# Altium project PirSensor.PrjPcb
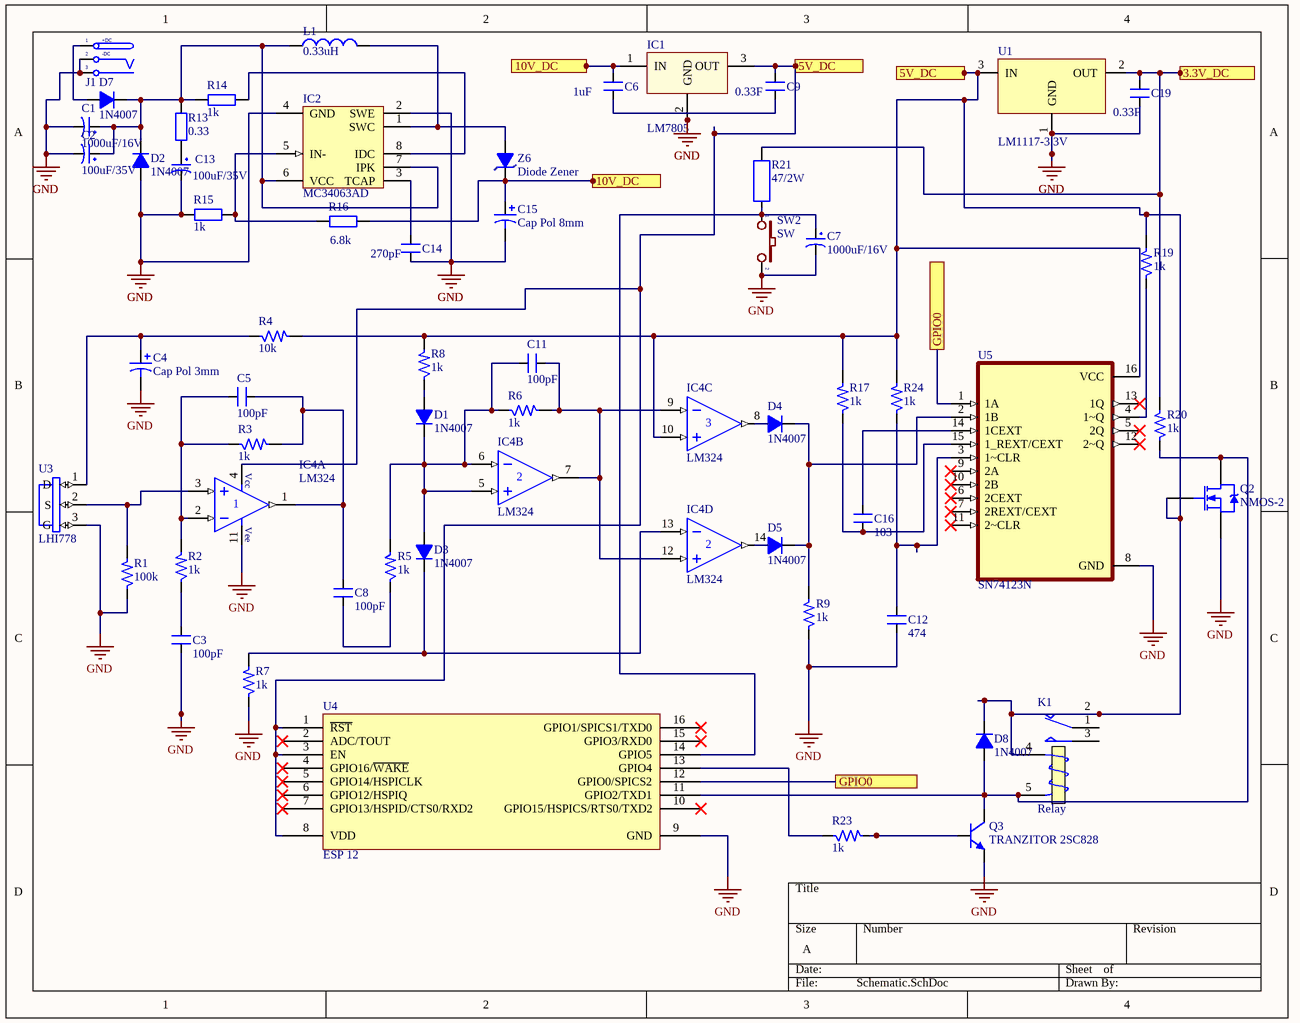
[diagram p0: Schematic.SchDoc]
1 sheet, 56 parts. Net scope: flat (ports and power ports of the same name join across sheets).
Board file: PCB.PcbDoc

## Sheet Schematic.SchDoc
size A; SheetNumber: 1; SheetTotal: 1

### Parts
C1  1000uF/16V  [CP1.5/3.4]
C2  100uF/35V  [CP1.5/3.4]
C3  100pF  [CN1]
C4  Cap Pol 3mm  [C3MM]
C5  100pF  [CN1]
C6  1uF  [CN1]
C7  1000uF/16V  [CP1.5/3.4]
C8  100pF  [CN1]
C9  0.33F  [CN1]
C11  100pF  [CN1]
C12  474  [CN4]
C13  100uF/35V  [CP1.5/3.4]
C14  270pF  [CN1]
C15  Cap Pol 8mm  [C10mm]
C16  103  [CN1.5]
C19  0.33F  [CN1]
D1  1N4007  [D2A]
D2  1N4007  [D1A]
D3  1N4007  [D2A]
D4  1N4007  [D2A]
D5  1N4007  [D2A]
D7  1N4007  [D1A]
D8  1N4007  [D1A]
IC1  LM7805  [QTO-220NH]
IC2  MC34063AD  [DIP8]
IC4  LM324  [DIP14]  (parts A,B,C,D of 4)
J1  JACK DC 5MM  [JACK DC 5MM]  (value not drawn)
K1  Relay  [MODULE5B]
L1  value 0.33uH  [PCMC063T]
Q2  NMOS-2  [TO-220AB]
Q3  TRANZITOR 2SC828  [TO126]
R1  100k  [R1/8W]
R2  1k  [R1/8W]
R3  1k  [R1/8W]
R4  10k  [R1/8W]
R5  1k  [R1/8W]
R6  1k  [R1/8W]
R7  1k  [R1/8W]
R8  1k  [R1/8W]
R9  1k  [R1/8W]
R13  0.33  [RES-1/4W]
R14  1k  [R1/8W]
R15  1k  [R1/8W]
R16  6.8k  [R1/8W]
R17  1k  [R1/8W]
R19  1k  [R1/8W]
R20  1k  [R1/4W]
R21  47/2W  [R2W]
R23  1k  [R1/4W]
R24  1k  [R1/8W]
SW2  SW  [SW2]
U1  LM1117-3.3V  [LM1117-SOP]
U3  LHI778  [SNR3-D8.1XH4.2MM]
U4  ESP 12  [ESP12]
U5  SN74123N  [DIP794W45P254L1969H508Q16]
Z6  Diode Zener  [D1A]

### Ports
3.3V_DC, 5V_DC, 10V_DC, GPIO0

### Nets
GND: C1.2 C2.2 C3.1 C4.2 C7.2 C12.1 C13.2 C14.1 C15.2 C19.1 D2.1(A) IC1.2(GND) IC2.2(SWE) IC2.4(GND) IC4.11(V-) J1.2(TN) J1.3(S) Q2.3(S) Q3.1(E) R1.1 R7.1 R9.1 R15.1 SW2.2 U1.1(GND) U3.3(G) U4.9(GND) U5.8(GND)
NetC1_1: C1.1 C2.1 D2.2(K) D7.2(K) IC2.6(VCC) IC2.7(IPK) L1.1 R13.2 R14.1
NetC3_2: C3.2 R2.1
NetC4_1: C4.1 R4.1 U3.1(D)
NetC5_1: C5.1 IC4.2(IN-) R2.2 R3.1
NetC5_2: C5.2 C8.2 IC4.1(OUT) R3.2
NetC6_1: C6.1 C9.1
NetC6_2: C6.2 C15.1 IC1.1(IN) R16.2 Z6.2(K) ; port 10V_DC
NetC7_1: C7.1 R21.1 SW2.1 U4.14(GPIO5)
NetC8_1: C8.1 R5.1
NetC9_2: C9.2 D8.2(K) IC1.3(OUT) IC4.4(V+) IC4.10(IN+) K1.2(NC) K1.4(T1) Q2.1(G) R4.2 R8.2 R17.2 R19.2 R24.2 U1.3(IN) U4.1(~{RST}) U4.3(EN) U4.8(VDD) U5.16(VCC) ; port 5V_DC
NetC11_1: C11.1 D1.2(K) D3.1(A) IC4.5(IN+) IC4.6(IN-) R5.2 R6.1
NetC11_2: C11.2 IC4.7(OUT) IC4.9(IN-) IC4.12(IN+) R6.2
NetC12_2: C12.2 R24.1 U5.3(1~CLR)
NetC13_1: C13.1 R13.1
NetC14_2: C14.2 IC2.3(TCAP)
NetC16_1: C16.1 R17.1 U5.15(1_REXT/CEXT)
NetC16_2: C16.2 U5.14(1CEXT)
NetC19_2: C19.2 R20.2 R21.2 U1.2(OUT) ; port 3.3V_DC
NetD1_1: D1.1(A) R8.1
NetD3_2: D3.2(K) IC4.13(IN-) R7.2
NetD4_1: D4.1(A) IC4.8(OUT)
NetD4_2: D4.2(K) D5.2(K) R9.2 U5.2(1B)
NetD5_1: D5.1(A) IC4.14(OUT)
NetD7_1: D7.1(A) J1.1(T)
NetD8_1: D8.1(A) K1.5(T2) Q2.2(D) Q3.3(B) R20.1 U4.11(GPIO2/TXD1)
NetIC2_1: IC2.1(SWC) L1.2 Z6.1(A)
NetIC2_5: IC2.5(IN-) R15.2 R16.1
NetIC2_8: IC2.8(IDC) R14.2
NetIC4_3: IC4.3(IN+) R1.2 U3.2(S)
NetQ3_2: Q3.2(C) R23.2
NetR19_1: R19.1 U5.4(1~Q)
NetR23_1: R23.1 U4.13(GPIO4)
NetU4_12: U4.12(GPIO0/SPICS2) U5.1(1A) ; port GPIO0

Not connected (* = marked no-connect by the designer): K1 1(COM) 3(NO); U4 2(ADC/TOUT)* 4(GPIO16/~{WAKE})* 5(GPIO14/HSPICLK)* 6(GPIO12/HSPIQ)* 7(GPIO13/HSPID/CTS0/RXD2)* 10(GPIO15/HSPICS/RTS0/TXD2)* 15(GPIO3/RXD0)* 16(GPIO1/SPICS1/TXD0)*; U5 5(2Q)* 6(2CEXT)* 7(2REXT/CEXT)* 9(2A)* 10(2B)* 11(2~CLR)* 12(2~Q)* 13(1Q)*

### Notes on the sheet
- (in symbol JACK DC 5MM) +DC; -DC
- (in symbol LM324, part A) Vcc; Vee

### Library data of the parts
C1 C7 = CP4: Cap 1000uF/16V - 220uF/50V; Description 5: 4,7uF>10uF/250V_3,3uF>10uF/400V - 2,2uF>4,7uF/450V; Description 1: 2200uF-3300uF/6,3V - 1000uF-2200uF/10V; Description 2: 1000uF/16V - 470uF => 1000uF/25V - 100uF/100V; Description 3: 330uF>470uF/35V_220uF>470uF/50V_10uF>22uF/250V; Description 4: 220uF => 330uF/63V - 10uF =>33uF/160 - 200V; Value: 1000uF/16V
C2 C13 = CP3: Cap 100uF/35V - 470uF/16V; Value: 100uF/35V/50V; Description 1: 1000uF/6,3V - 470uF/16V - 330uF - 25V; Description 2: 220uF/35V - 100uF/50V - 63V - 4,7uF/200V; Description 3: 22uF => 33uF100V - 3,3uF => 4,7uF/250V; Description 4: 2,2uF =>3,3uF/350 - 2,2uF/400V - 1uF/450V
C3 C5 C8 C11 = CN1: Cap np  1pF - 472pF; Value: 100pF
C4 = Cap Pol 3mm: Polarized Capacitor (Axial); Published: 8-Jun-2000; LatestRevisionDate: 17-Jul-2002; LatestRevisionNote: Re-released for DXP Platform.; PackageReference: POLAR0.8; Publisher: Altium Limited
C6 C9 C14 C19 = CN1: Cap np  1pF - 472pF; Value: 100pF
C12 = CN4: Cap np W0.4; Value: 0.47uF
C15 = Cap Pol 8mm: Polarized Capacitor (Axial); Published: 8-Jun-2000; LatestRevisionDate: 17-Jul-2002; LatestRevisionNote: Re-released for DXP Platform.; PackageReference: POLAR0.8; Publisher: Altium Limited
C16 = CN1.5: Cap np 682pF => 104pF; Value: 0.01uF
D1-D5 D7 D8 = D1A: Diode 1A; Value: 1N4007
IC1 = LM78xx: On ap +, from + 5 to + 24VDC; Value: LM7805
IC2 = MC34063AD: DC-to-DC Converter Control Circuit; Published: 15-Apr-2002; LatestRevisionDate: 13-Apr-2006; LatestRevisionNote: IPC-7351 Footprint Added.; DatasheetVersion: 1996; PackageVersion: 1998; PackageReference: 751-05; Publisher: Altium Limited; PackageDescription: 8-Pin Small Outline Integrated Circuit 1.27 mm Pitch; Code_JEDEC: MS-012-AA; Code_IPC: SOIC127P600-8; ComponentLink1Description: Manufacturer Link; ComponentLink1URL: http://www.onsemi.com/site/products/taxonomy/0,4438,503,00.html; ComponentLink2Description: Datasheet; ComponentLink2URL: http://www.onsemi.com/pub/Collateral/MC34063A-D.PDF
IC4 = LM324: Op x 4; Value: LM324
K1 = Relay: SPDT Relay; Published: 8-Jun-2000; LatestRevisionDate: 17-Jul-2002; LatestRevisionNote: Re-released for DXP Platform.; PackageReference: MODULE5B; Publisher: Altium Limited
L1 = PCMC063T-R33MN: SMT Power Choke Coil; Size 7.3×6.6×3.0mm, ±20% Tolerance, 0.33uH, 20A; PCB_Layout: Complies with manufacturer's recommendation.; Published: 26-Sep-2008; DatasheetVersion: Oct-2007; PackageVersion: Oct-2007; PackageReference: PCMC063T; Publisher: Altium Limited; PackageDescription: SM Power Choke Coil; 2 Leads; Body 7.3 x 6.6 x 3.0 mm (LxWxH); ComponentLink1Description: Manufacturer Link; ComponentLink1URL: http://www.susumu.co.jp/; ComponentLink2Description: Datasheet; ComponentLink2URL: http://www.susumu.co.jp/english/pdf/products-j07-01.pdf
Q2 = NMOS-2: N-Channel Power MOSFET; Note: Pin 2 is electrically connected to pin 4.; Published: 8-Jun-2000; LatestRevisionDate: 17-Jul-2002; LatestRevisionNote: Re-released for DXP Platform.; DatasheetVersion: PD-9.814; PackageVersion: Feb-1997; PackageReference: TO-220AB; Publisher: Altium Limited; PackageDescription: TO, Thru-Hole, Vertical, Heatsink Mounted; 3 In-Line Leads; Pitch 2.54 mm; ComponentLink1Description: Manufacturer Link; ComponentLink1URL: http://www.irf.com/
Q3 = TRANZITOR 2SC828: NPN General Purpose Amplifier; Published: 8-Jun-2000; LatestRevisionDate: 15-Jan-2003; LatestRevisionNote: PCB Footprint 'BCY-W3/D4.7' replaced; DatasheetDocument: 1997; PackageReference: TO-92A; Publisher: Altium Limited; Code_JEDEC: TO-92A
R1 R4 = Res: Resistor 1/4W; Value: R1/4W - 1K
R2 R3 R5-R9 R17 R19 R20 R23 R24 = R: Resistor 1/4W; Value: R1/4W - 1K
R13 = R: Resistor R1/4W
R14-R16 = R1/4W: Resistor 1/4W; Value: R1/4W - 1K
R21 = R2W: Resistor 2W; Value: R2W - 47
SW2 = SW2: Switch button 2 pin; Value: SW chip 2 pin
U1 = LM1117: 800mA Low-Dropout Linear Regulator; Creator: Nguyen Ba Bien; Website: http://group3i.net
U3 = DIP-MOTION/POSITION-LHI778(3P-D8.1MM): DIP PIR Motion Sensor; MF: PerkinElmer Optoelectronics; SnapEDA_Link: https://www.snapeda.com/parts/LHI778/PerkinElmer%20Optoelectronics/view-part/550014/?ref=snap; Availability: Unavailable; Price: None; Value: *; MP: LHI778; Package: None
U4 = ESP_12: ESP-12 Wi-Fi Module by AI-Thinker; IC: ESP8266-EX; Vendor: Ai-thinker
Z6 = Diode Zener: Diode  Zener
U5 = SN74123N: Package: None; Price: None; Value: *; MP: SN74123N; Availability: Unavailable